# EAGLE design unoshield-v1 (EAGLE 9.6.2)
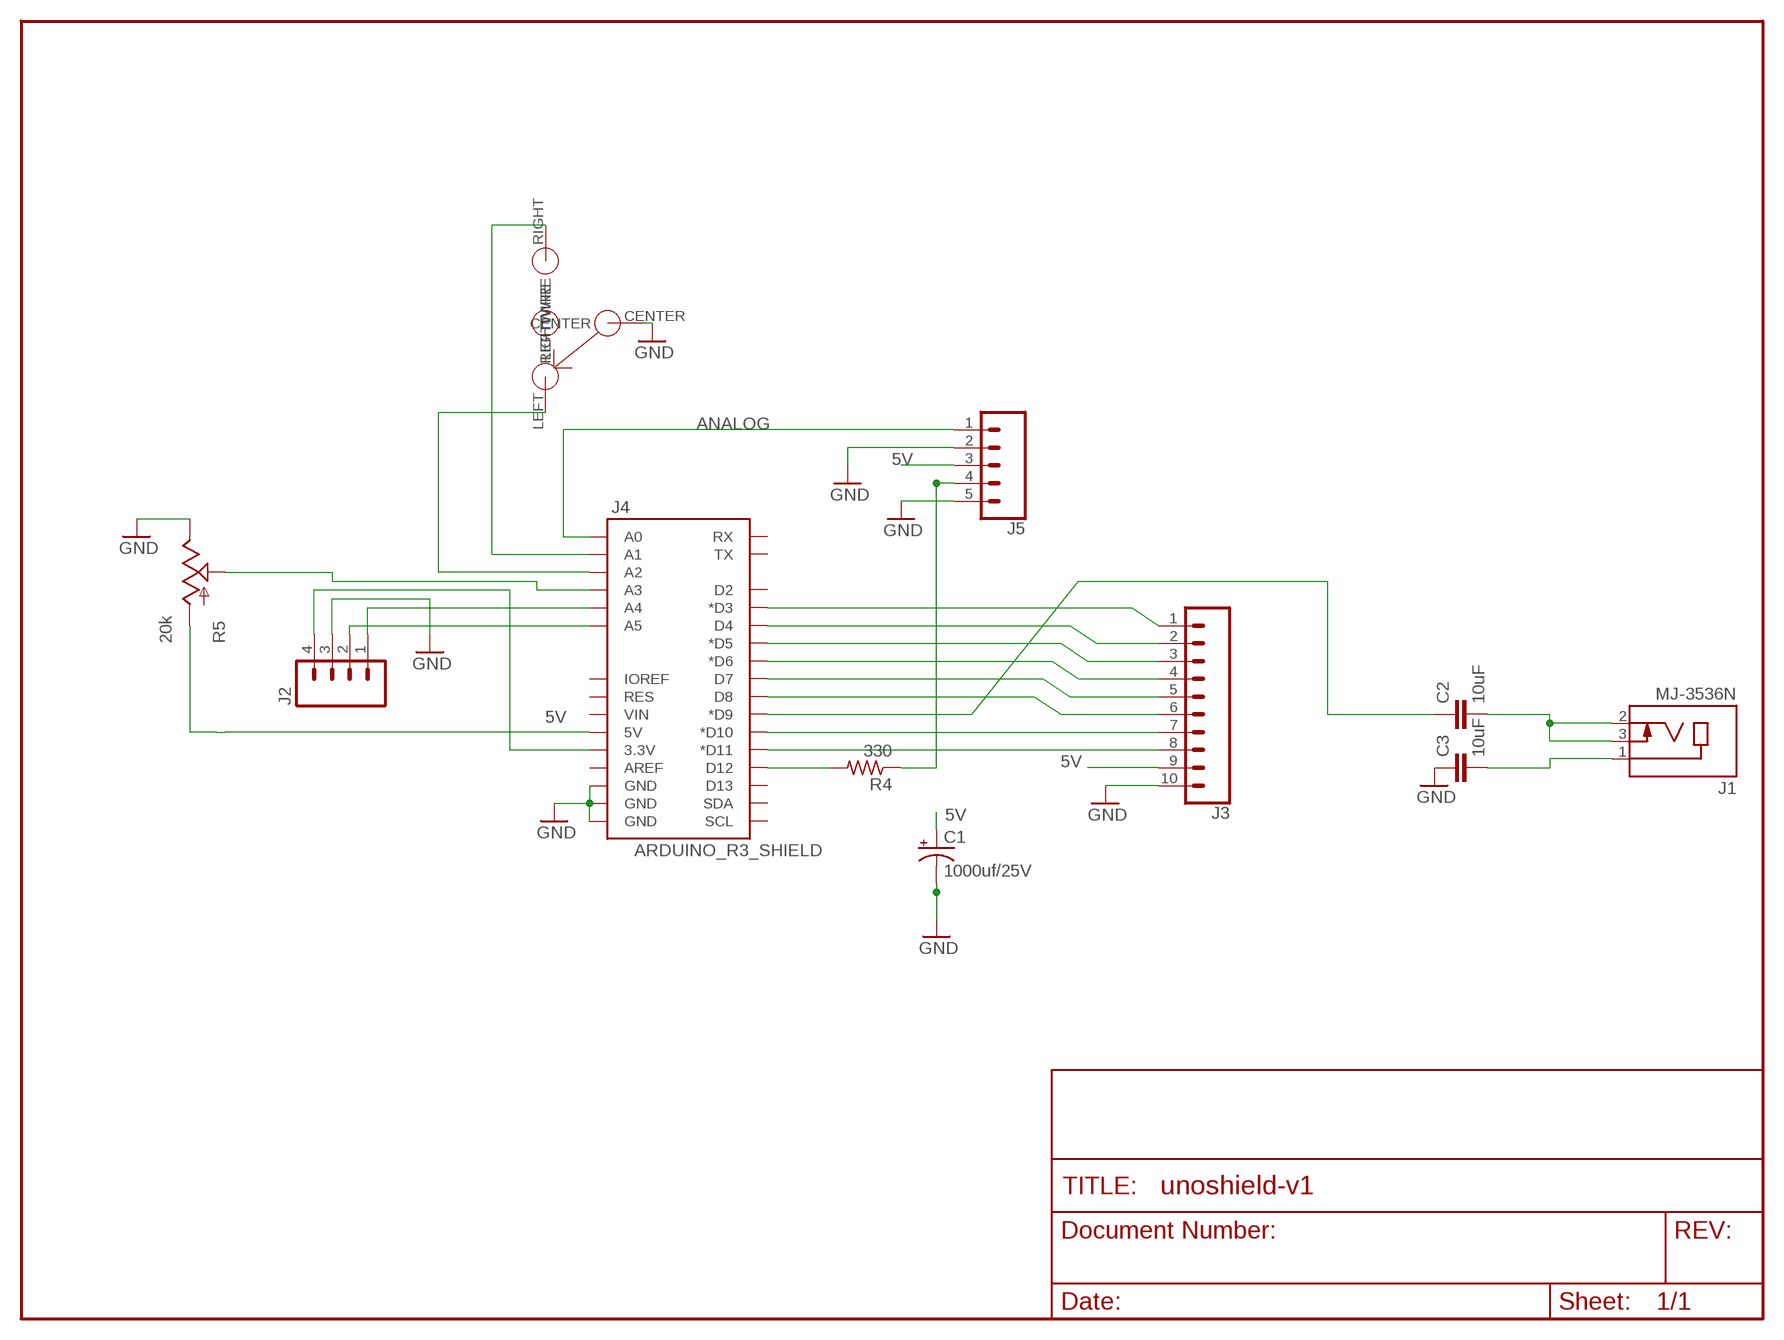
[diagram p0: schematic, sheet 1]

## Parts
C1  1000uf/25V  1000UF-25V(PTH)KIT  [CPOL-RADIAL-1000UF-25V-KIT]
C2  10uF  10UF-0805-10V-10%  [0805]
C3  10uF  10UF-0805-10V-10%  [0805]
J1  MJ-3536N  [CUI_MJ-3536N]
J2  M04PTH  [1X04]
J3  CONN_10"  [1X10]
J4  ARDUINO_R3_SHIELD  [UNO_R3_SHIELD]
J5  CONN_05  [1X05]
R4  330  R-US_R0603  [R0603]
R5  20k  POTALPS-KIT  [ALPS_POT_KIT]
SW3  ON-OFF-ON-360-1013-ND  [360-1013-ND]

## Nets
5V: C1.+ J3.9 J4.5V J5.3 R5.P$3(A)
ANALOG: J4.A0 J5.1
BUTTON: J4.A1 SW3.RIGHT(RIGHTWIRE)
CL: J2.2 J4.A5
DA: J2.1 J4.A4
GND: C1.- C3.1 J2.3 J3.10 J4.GND@0(GND) J4.GND@1(GND) J4.GND@2(GND) J5.2 J5.5 R5.P$1(E) SW3.CENTER
N$1: J4.D12 R4.2
N$4: J4.A3 R5.P$2(S)
N$5: J3.8 J4.D11(*D11)
N$6: J3.7 J4.D10(*D10)
N$7: J3.6 J4.D8
N$8: J3.5 J4.D7
N$9: J3.4 J4.D6(*D6)
N$10: J3.3 J4.D5(*D5)
N$11: J3.2 J4.D4
N$12: J4.A2 SW3.LEFT(LEFTWIRE)
N$13: J3.1 J4.D3(*D3)
N$14: C3.2 J1.1
N$15: C2.2 J1.2 J1.3
N$16: C2.1 J4.D9(*D9)
N$17: J5.4 R4.1
VCC: J2.4 J4.3.3V
Unconnected: J4.AREF J4.D2 J4.D13 J4.IOREF J4.RES J4.RX J4.SCL J4.SDA J4.TX J4.VIN

## Library data of the parts
C1 = SparkFun-Capacitors:1000UF-25V(PTH): CAP-08070; PROD_ID: CAP-09538
C2 C3 = SparkFun-Capacitors:10UF: 10.0µF ceramic capacitors A capacitor is a passive two-terminal electrical component used to store electrical energy temporarily in an electric field.; PROD_ID: CAP-11330
J1 = MJ-3536N:MJ-3536N: 2 Conductors 3 Contacts 12V 3.5 mm Right Angle Through Hole Audio Jack Connector; MANUFACTURER: CUI INC; PART_REV: B; STANDARD: MANUFACTURER RECOMMENDATIONS
J2 = SparkFun-Connectors:M04: Header 4 Standard 4-pin 0.1" header. Use with straight break away headers (SKU : PRT-00116), right angle break away headers (PRT-00553), swiss pins (PRT-00743), machine pins (PRT-00117), and female headers (PRT-00115). Molex polarized connector foot print use with SKU : PRT-08231 with associated crimp pins and housings. 1MM SMD Version SKU: PRT-10208
J3 = SparkFun-Connectors:CONN_10: Multi connection point. Often used as Generic Header-pin footprint for 0.1 inch spaced/style header connections On any of the 0.1 inch spaced packages, you can populate with these: Break Away Headers - Straight <https://www.sparkfun.com/products/116> (PRT-00116) Break Away Male Headers - Right Angle <https://www.sparkfun.com/products/553> (PRT-00553) Female Headers <https://www.sparkfun.com/products/115> (PRT-00115) Break Away Headers - Machine Pin <https://www.sparkfun.com/products/117> (PRT-00117) Break Away Female Headers - Swiss Machine Pin <https://www.sparkfun.com/products/743> (PRT-00743) Arduino Stackable Header - 10 Pin <https://www.sparkfun.com/products/11376> (PRT-11376) For SCREWTERMINALS and SPRING TERMINALS visit here: Screw Terimnals on SparkFun.com <https://www.sparkfun.com/search/results?term=Screw+Terminals> (5mm/3.5mm/2.54mm spacing) This device is also useful as a general connection point to wire up your design to another part of your project. Our various solder wires solder well into these plated through hole pads. Hook-Up Wire - Assortment (Stranded, 22 AWG) <https://www.sparkfun.com/products/11375> (PRT-11375) Hook-Up Wire - Assortment (Solid Core, 22 AWG) <https://www.sparkfun.com/products/11367> (PRT-11367) View the entire wire category on our website here <https://www.sparkfun.com/categories/141> Special notes: Molex polarized connector foot print use with SKU : PRT-08231 with associated crimp pins and housings. 1MM SMD Version SKU: PRT-10208 NOTES ON THE VARIANTS LOCK and LOCK_LONGPADS... This footprint was designed to help hold the alignment of a through-hole component (i.e. 6-pin header) while soldering it into place. You may notice that each hole has been shifted either up or down by 0.005 of an inch from it's more standard position (which is a perfectly straight line). This slight alteration caused the pins (the squares in the middle) to touch the edges of the holes. Because they are alternating, it causes a "brace" to hold the component in place. 0.005 has proven to be the perfect amount of "off-center" position when using our standard breakaway headers. Although looks a little odd when you look at the bare footprint, once you have a header in there, the alteration is very hard to notice. Also,if you push a header all the way into place, it is covered up entirely on the bottom side.; PROD_ID: CONN-11563
J4 = SparkFun-Boards:ARDUINO_R3_SHIELD: Shield form compatible with the Arduino Uno R3.
J5 = SparkFun-Connectors:CONN_05: Multi connection point. Often used as Generic Header-pin footprint for 0.1 inch spaced/style header connections On any of the 0.1 inch spaced packages, you can populate with these: Break Away Headers - Straight <https://www.sparkfun.com/products/116> (PRT-00116) Break Away Male Headers - Right Angle <https://www.sparkfun.com/products/553> (PRT-00553) Female Headers <https://www.sparkfun.com/products/115> (PRT-00115) Break Away Headers - Machine Pin <https://www.sparkfun.com/products/117> (PRT-00117) Break Away Female Headers - Swiss Machine Pin <https://www.sparkfun.com/products/743> (PRT-00743) For SCREWTERMINALS and SPRING TERMINALS visit here: Screw Terimnals on SparkFun.com <https://www.sparkfun.com/search/results?term=Screw+Terminals> (5mm/3.5mm/2.54mm spacing) This device is also useful as a general connection point to wire up your design to another part of your project. Our various solder wires solder well into these plated through hole pads. Hook-Up Wire - Assortment (Stranded, 22 AWG) <https://www.sparkfun.com/products/11375> (PRT-11375) Hook-Up Wire - Assortment (Solid Core, 22 AWG) <https://www.sparkfun.com/products/11367> (PRT-11367) View the entire wire category on our website here <https://www.sparkfun.com/categories/141> Special notes: Molex polarized connector foot print use with SKU : PRT-08231 with associated crimp pins and housings. 1MM SMD Version SKU: PRT-10208
R4 = resistor:R-US_: RESISTOR, American symbol
R5 = SparkFun-Electromechanical:POT
SW3 = spietz-library:ON-OFF-ON-360-1013-ND

## Net classes
0 default: width 0.203 mm
1 vcc: width 0.254 mm

## Board
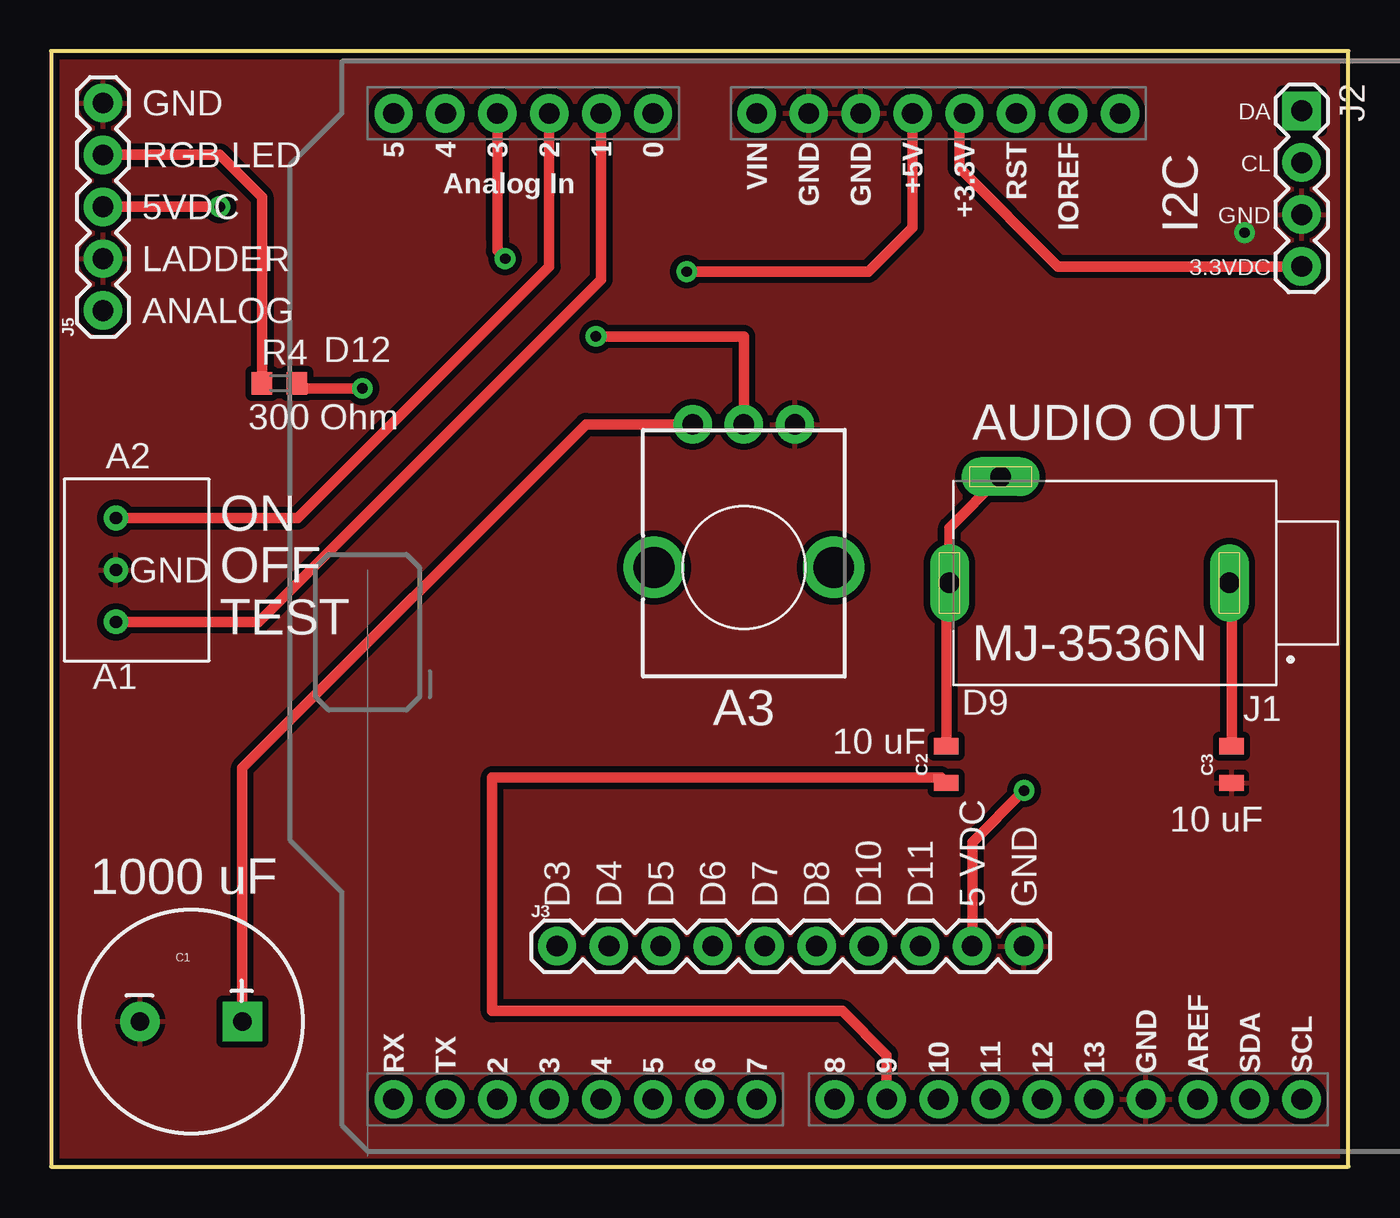
[diagram p1: board, top side]
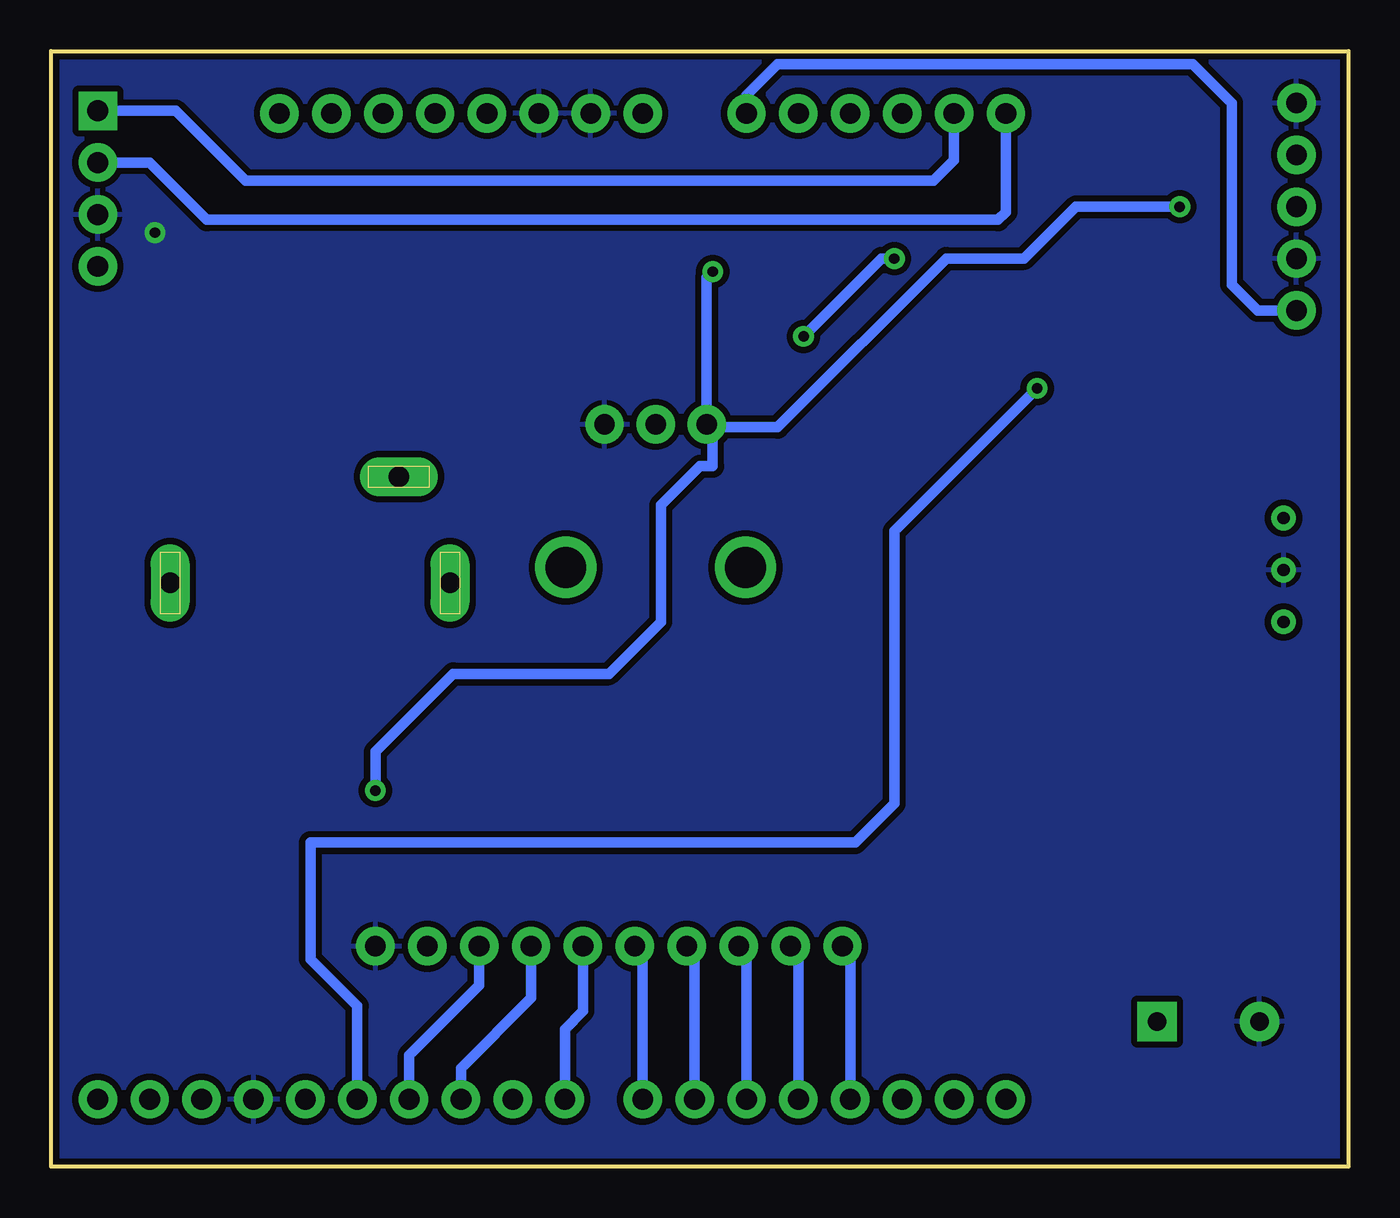
[diagram p2: board, bottom side, seen from below]

Size 63.5 x 54.61 mm. Coordinates in mm from the lower left corner, seen from the top.
Outline: 0,0 63.5,0 63.5,54.61 0,54.61 0,0
Copper layers (1*16): Top 0.035mm / dielectric 1.5mm / Bottom 0.035mm
Design rules "default": minimum track width 8mil, minimum drill 20mil, track to track 8mil, track to pad 8mil, pad to pad 8mil, via to via 8mil, smd to smd 8mil, copper to edge 10mil, drill to drill 8mil, minimum pad ring 12mil, minimum via ring 10mil, stop-mask expansion 4mil, vias tented up to drill 25mil, thermal gap 10mil

### Footprints (pad centres in the part's own frame; a part is rotated, then mirrored left to right if it is on the bottom)
CPOL-RADIAL-1000UF-25V-KIT = drill 0.9 pad 1.93 square: + 2.5,0 | drill 0.9 pad 1.93: - -2.5,0
0805 = smd 0.8 x 1.2: 1 -0.9,0; 2 0.9,0
CUI_MJ-3536N = drill 1 pad 1.9 long: 1 -5.6,0; 2 8.1,0; 3 5.6,-5.2
1X04 = drill 1.016 pad 1.88 square: 1 0,0 | drill 1.016 pad 1.88: 2 2.54,0; 3 5.08,0; 4 7.62,0
1X10 = drill 1.016 pad 1.88: 1 0,0; 2 2.54,0; 3 5.08,0; 4 7.62,0; 5 10.16,0; 6 12.7,0; 7 15.24,0; 8 17.78,0; 9 20.32,0; 10 22.86,0
UNO_R3_SHIELD = drill 1.016 pad 1.88: 3.3V 50.8,26.67; 5V 50.8,29.21; A0 50.8,41.91; A1 50.8,44.45; A2 50.8,46.99; A3 50.8,49.53; A4 50.8,52.07; A5 50.8,54.61; AREF 2.54,15.24; D2 2.54,49.53; D3 2.54,46.99; D4 2.54,44.45; D5 2.54,41.91; D6 2.54,39.37; D7 2.54,36.83; D8 2.54,33.02; D9 2.54,30.48; D10 2.54,27.94; D11 2.54,25.4; D12 2.54,22.86; D13 2.54,20.32; GND@0 50.8,31.75; GND@1 50.8,34.29; GND@2 2.54,17.78; IOREF 50.8,21.59; NC 50.8,19.05; RES 50.8,24.13; RX 2.54,54.61; SCL 2.54,10.16; SDA 2.54,12.7; TX 2.54,52.07; VIN 50.8,36.83
1X05 = drill 1.016 pad 1.88: 1 0,0; 2 2.54,0; 3 5.08,0; 4 7.62,0; 5 10.16,0
R0603 = smd 1 x 1.1: 1 -0.85,0; 2 0.85,0
ALPS_POT_KIT = drill 1 pad 1.88: P$1 7,-2.5; P$2 7,0; P$3 7,2.5 | drill 2: P$4 0,-4.4; P$5 0,4.4
360-1013-ND = drill 0.6: CENTER 0,0; LEFT -2.54,0; RIGHT 2.54,0

### Placement (x,y rotation side)
C1  6.86,7.11 0 top
C2  43.81,19.68 90 top
C3  57.78,19.68 90 top
J1  52.07,28.57 180 top
J2  61.21,51.69 270 top
J3  24.77,10.79 0 top
J4  71.37,0.76 90 top
J5  2.54,41.91 90 top
R4  11.18,38.35 0 top
R5  33.91,29.34 90 top
SW3  3.17,29.21 270 top

### Tracks (layer width: path | path; a pad name or v marks a point on that pad's centre or on a via)
5V  (via drill 0.51)
  Top 0.508: C1.+ 9.36,19.52 26.18,36.34 R5.P$3 | J4.5V 42.16,45.97 40.01,43.81 v31.11,43.81 | J5.3 v8.26,46.99 | J3.9 45.09,15.88 v47.62,18.41
  Bottom 0.508: R5.P$3 31.27,36.2 27.94,36.2 19.68,44.45 15.88,44.45 13.34,46.99 v8.26,46.99 | v31.11,43.81 31.41,43.52 R5.P$3 | v47.62,18.41 47.62,20.32 43.81,24.13 36.2,24.13 33.66,26.67 33.66,32.38 31.75,34.29 31.11,34.29 31.11,36.04 R5.P$3
ANALOG
  Bottom 0.508: J4.A0 29.46,52.45 27.94,53.98 7.62,53.98 5.71,52.07 5.71,43.18 4.45,41.91 J5.1
BUTTON
  Top 0.508: J4.A1 26.92,43.43 10.16,26.67 SW3.RIGHT
CL
  Bottom 0.508: J4.A5 16.76,47.62 16.76,47.24 16.76,46.74 17.14,46.35 55.88,46.35 58.67,49.15 J2.2
DA
  Bottom 0.508: J2.1 57.4,51.69 53.98,48.26 20.32,48.26 19.3,49.28 J4.A4
GND  (via drill 0.51)
  other vias: 58.42,45.72
  pour Top (isolate 0.305): -1.91,-1.27 -1.91,56.52 64.14,56.52 64.14,-1.27
  pour Bottom (isolate 0.305): -3.81,-2.54 -3.81,56.52 65.41,56.52 65.41,-2.54
N$1  (via drill 0.51)
  Top 0.508: R4.2 12.28,38.1 v15.24,38.1
  Bottom 0.508: J4.D12 48.51,7.87 50.8,10.16 50.8,15.88 24.13,15.88 22.23,17.78 22.23,31.11 v15.24,38.1
N$4  (via drill 0.51)
  Top 0.508: R5.P$2 33.91,40.64 v26.67,40.64 | J4.A3 21.84,45.72 21.84,45.47 21.84,44.83 v22.23,44.45
  Bottom 0.508: v22.23,44.45 22.86,44.45 v26.67,40.64
N$5
  Bottom 0.508: J4.D11 45.97,5.46 42.55,8.89 J3.8
N$6
  Bottom 0.508: J3.7 40.01,8.26 43.43,4.83 J4.D10
N$7
  Bottom 0.508: J4.D8 38.35,6.73 37.47,7.62 J3.6
N$8
  Bottom 0.508: J4.D7 34.54,10.41 J3.5
N$9
  Bottom 0.508: J4.D6 32,10.41 J3.4
N$10
  Bottom 0.508: J4.D5 29.46,10.41 J3.3
N$11
  Bottom 0.508: J4.D4 26.92,10.41 J3.2
N$12
  Top 0.508: J4.A2 24.38,44.07 12.06,31.75 SW3.LEFT
N$13
  Bottom 0.508: J4.D3 24.38,10.41 J3.1
N$14
  Top 0.508: C3.2 57.78,28.46 J1.1
N$15
  Top 0.508: C2.2 43.81,28.42 J1.2 43.97,31.27 J1.3
N$16
  Top 0.508: J4.D9 40.89,5.46 38.73,7.62 21.59,7.62 21.59,19.05 43.55,19.05 C2.1
N$17
  Top 0.508: J5.4 8.26,49.53 10.33,47.46 R4.1
VCC
  Top 0.508: J2.4 49.28,44.07 44.45,48.9 44.45,51.31 J4.3.3V

### Text on the board
tPlace: DA | GND | CL | RGB LED | GND | 5VDC | I2C | LADDER | 3.3VDC | ANALOG | D12 | 300 Ohm | AUDIO OUT | A2 | ON | GND | OFF | TEST | MJ-3536N | A1 | A3 | D9 | 10 uF | 10 uF | 1000 uF | D3 | D4 | D5 | D6 | D7 | D8 | D10 | D11 | 5 VDC | GND
tValues: Tent Vias! | Arduino Wee v1.3